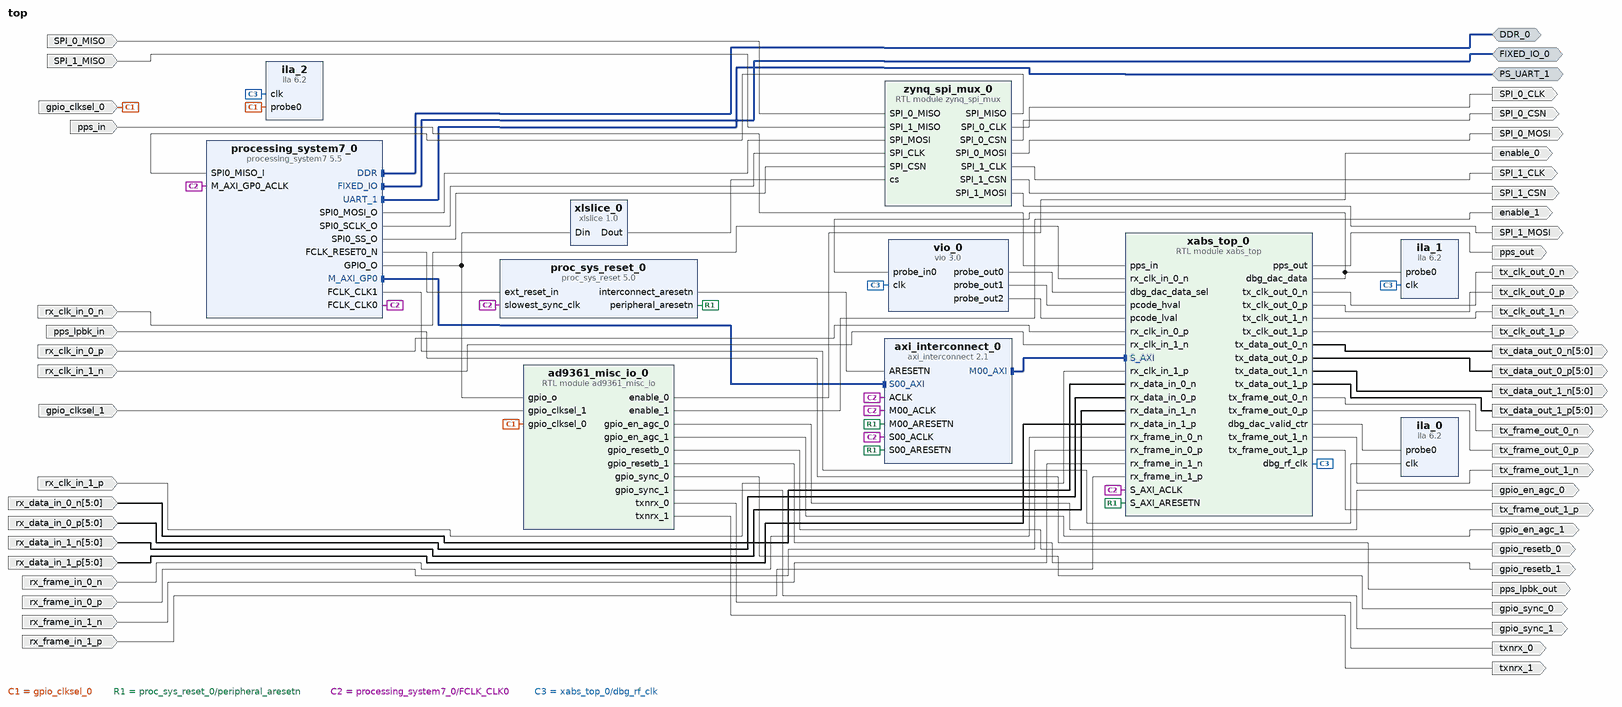
[diagram p0: block diagram of the top level]
# Vivado block design top, xc7z020clg400-2, Vivado 2023.2
create_bd_design top

create_bd_intf_port -mode Master -vlnv xilinx.com:interface:ddrx_rtl:1.0 DDR_0
create_bd_intf_port -mode Master -vlnv xilinx.com:display_processing_system7:fixedio_rtl:1.0 FIXED_IO_0
create_bd_intf_port -mode Master -vlnv xilinx.com:interface:uart_rtl:1.0 PS_UART_1
create_bd_port -dir I pps_in
create_bd_port -dir I rx_clk_in_0_n
create_bd_port -dir I rx_clk_in_0_p
create_bd_port -dir I rx_clk_in_1_n
create_bd_port -dir I rx_clk_in_1_p
create_bd_port -dir I -from 5 -to 0 rx_data_in_0_n
create_bd_port -dir I -from 5 -to 0 rx_data_in_0_p
create_bd_port -dir I -from 5 -to 0 rx_data_in_1_n
create_bd_port -dir I -from 5 -to 0 rx_data_in_1_p
create_bd_port -dir I rx_frame_in_0_n
create_bd_port -dir I rx_frame_in_0_p
create_bd_port -dir I rx_frame_in_1_n
create_bd_port -dir I rx_frame_in_1_p
create_bd_port -dir O tx_clk_out_0_n
create_bd_port -dir O tx_clk_out_0_p
create_bd_port -dir O tx_clk_out_1_n
create_bd_port -dir O tx_clk_out_1_p
create_bd_port -dir O -from 5 -to 0 tx_data_out_0_n
create_bd_port -dir O -from 5 -to 0 tx_data_out_0_p
create_bd_port -dir O -from 5 -to 0 tx_data_out_1_n
create_bd_port -dir O -from 5 -to 0 tx_data_out_1_p
create_bd_port -dir O tx_frame_out_0_n
create_bd_port -dir O tx_frame_out_0_p
create_bd_port -dir O tx_frame_out_1_n
create_bd_port -dir O tx_frame_out_1_p
create_bd_port -dir O enable_0
create_bd_port -dir O enable_1
create_bd_port -dir I gpio_clksel_0
create_bd_port -dir I gpio_clksel_1
create_bd_port -dir O gpio_en_agc_0
create_bd_port -dir O gpio_en_agc_1
create_bd_port -dir O gpio_resetb_0
create_bd_port -dir O gpio_resetb_1
create_bd_port -dir O gpio_sync_0
create_bd_port -dir O gpio_sync_1
create_bd_port -dir O txnrx_0
create_bd_port -dir O txnrx_1
create_bd_port -dir O -type clk SPI_0_CLK
create_bd_port -dir O SPI_0_CSN
create_bd_port -dir I SPI_0_MISO
create_bd_port -dir O SPI_0_MOSI
create_bd_port -dir O -type clk SPI_1_CLK
create_bd_port -dir O SPI_1_CSN
create_bd_port -dir I SPI_1_MISO
create_bd_port -dir O SPI_1_MOSI
create_bd_port -dir O pps_out
create_bd_port -dir I pps_lpbk_in
create_bd_port -dir O pps_lpbk_out

create_bd_cell -type ip -vlnv xilinx.com:ip:processing_system7:5.5 processing_system7_0
set_property -dict [list \
  CONFIG.PCW_APU_PERIPHERAL_FREQMHZ 767 \
  CONFIG.PCW_CPU_CPU_6X4X_MAX_RANGE 767 \
  CONFIG.PCW_DUAL_STACK_QSPI_DATA_MODE x4 \
  CONFIG.PCW_ENET0_ENET0_IO {MIO 16 .. 27} \
  CONFIG.PCW_ENET0_GRP_MDIO_ENABLE 1 \
  CONFIG.PCW_ENET0_GRP_MDIO_IO {MIO 52 .. 53} \
  CONFIG.PCW_ENET0_PERIPHERAL_ENABLE 1 \
  CONFIG.PCW_ENET_RESET_ENABLE 0 \
  CONFIG.PCW_EN_CLK1_PORT 1 \
  CONFIG.PCW_FCLK_CLK0_BUF FALSE \
  CONFIG.PCW_FPGA0_PERIPHERAL_FREQMHZ 100 \
  CONFIG.PCW_FPGA1_PERIPHERAL_FREQMHZ 200 \
  CONFIG.PCW_FPGA_FCLK1_ENABLE 1 \
  CONFIG.PCW_GPIO_EMIO_GPIO_ENABLE 1 \
  CONFIG.PCW_GPIO_EMIO_GPIO_IO 64 \
  CONFIG.PCW_GPIO_MIO_GPIO_ENABLE 1 \
  CONFIG.PCW_GPIO_MIO_GPIO_IO MIO \
  CONFIG.PCW_I2C_RESET_ENABLE 1 \
  CONFIG.PCW_IRQ_F2P_INTR 1 \
  CONFIG.PCW_PERIPHERAL_BOARD_PRESET None \
  CONFIG.PCW_PRESET_BANK1_VOLTAGE {LVCMOS 1.8V} \
  CONFIG.PCW_QSPI_GRP_SINGLE_SS_ENABLE 0 \
  CONFIG.PCW_QSPI_GRP_SS1_ENABLE 1 \
  CONFIG.PCW_QSPI_GRP_SS1_IO {MIO 0} \
  CONFIG.PCW_QSPI_INTERNAL_HIGHADDRESS 0xFDFFFFFF \
  CONFIG.PCW_QSPI_PERIPHERAL_ENABLE 1 \
  CONFIG.PCW_QSPI_QSPI_IO {MIO 1 .. 6} \
  CONFIG.PCW_SD0_GRP_CD_ENABLE 1 \
  CONFIG.PCW_SD0_GRP_CD_IO {MIO 46} \
  CONFIG.PCW_SD0_GRP_WP_ENABLE 0 \
  CONFIG.PCW_SD0_PERIPHERAL_ENABLE 1 \
  CONFIG.PCW_SD0_SD0_IO {MIO 40 .. 45} \
  CONFIG.PCW_SDIO_PERIPHERAL_FREQMHZ 100 \
  CONFIG.PCW_SPI0_PERIPHERAL_ENABLE 1 \
  CONFIG.PCW_SPI0_SPI0_IO EMIO \
  CONFIG.PCW_UART0_PERIPHERAL_ENABLE 1 \
  CONFIG.PCW_UART0_UART0_IO {MIO 10 .. 11} \
  CONFIG.PCW_UART1_PERIPHERAL_ENABLE 1 \
  CONFIG.PCW_UART1_UART1_IO EMIO \
  CONFIG.PCW_UART_PERIPHERAL_FREQMHZ 100 \
  CONFIG.PCW_UIPARAM_DDR_BUS_WIDTH {16 Bit} \
  CONFIG.PCW_UIPARAM_DDR_FREQ_MHZ 533.333 \
  CONFIG.PCW_UIPARAM_DDR_MEMORY_TYPE {DDR 3 (Low Voltage)} \
  CONFIG.PCW_UIPARAM_DDR_PARTNO {MT41K256M16 RE-125} \
  CONFIG.PCW_USB0_PERIPHERAL_ENABLE 1 \
  CONFIG.PCW_USB0_RESET_ENABLE 1 \
  CONFIG.PCW_USB0_RESET_IO {MIO 51} \
  CONFIG.PCW_USB0_USB0_IO {MIO 28 .. 39} \
  CONFIG.PCW_USB_RESET_ENABLE 1 \
  CONFIG.PCW_USB_RESET_SELECT {Share reset pin} \
  CONFIG.PCW_USE_FABRIC_INTERRUPT 1 \
  CONFIG.preset None \
] [get_bd_cells processing_system7_0]
# 512 more settings of processing_system7_0 are not shown: defaults, MIO pin electricals, DDR timing, and values the tool derives
create_bd_cell -type ip -vlnv xilinx.com:ip:proc_sys_reset:5.0 proc_sys_reset_0
create_bd_cell -type ip -vlnv xilinx.com:ip:axi_interconnect:2.1 axi_interconnect_0
set_property -dict {CONFIG.NUM_MI 1} [get_bd_cells axi_interconnect_0]
create_bd_cell -type ip -vlnv xilinx.com:ip:xlslice:1.0 xlslice_0
set_property -dict {CONFIG.DIN_FROM 4 CONFIG.DIN_TO 3 CONFIG.DIN_WIDTH 64 CONFIG.DOUT_WIDTH 2} [get_bd_cells xlslice_0]
create_bd_cell -type module -reference ad9361_misc_io ad9361_misc_io_0
create_bd_cell -type module -reference zynq_spi_mux zynq_spi_mux_0
create_bd_cell -type ip -vlnv xilinx.com:ip:ila:6.2 ila_0
set_property -dict {CONFIG.C_MONITOR_TYPE Native} [get_bd_cells ila_0]
create_bd_cell -type ip -vlnv xilinx.com:ip:vio:3.0 vio_0
set_property -dict [list \
  CONFIG.C_EN_PROBE_IN_ACTIVITY 0 \
  CONFIG.C_NUM_PROBE_IN 1 \
  CONFIG.C_NUM_PROBE_OUT 3 \
  CONFIG.C_PROBE_OUT0_WIDTH 8 \
  CONFIG.C_PROBE_OUT1_INIT_VAL 0x800 \
  CONFIG.C_PROBE_OUT1_WIDTH 12 \
  CONFIG.C_PROBE_OUT2_INIT_VAL 0x7ff \
  CONFIG.C_PROBE_OUT2_WIDTH 12 \
] [get_bd_cells vio_0]
create_bd_cell -type ip -vlnv xilinx.com:ip:ila:6.2 ila_1
set_property -dict {CONFIG.C_MONITOR_TYPE Native} [get_bd_cells ila_1]
create_bd_cell -type module -reference xabs_top xabs_top_0
set_property -dict {CONFIG.MESSAGE_LEN 100 CONFIG.PCODE_LEN 20460} [get_bd_cells xabs_top_0]
create_bd_cell -type ip -vlnv xilinx.com:ip:ila:6.2 ila_2
set_property -dict {CONFIG.C_DATA_DEPTH 1024 CONFIG.C_MONITOR_TYPE Native} [get_bd_cells ila_2]

# ---- connections ----

connect_bd_intf_net [get_bd_intf_pins axi_interconnect_0/S00_AXI] [get_bd_intf_pins processing_system7_0/M_AXI_GP0]
connect_bd_intf_net [get_bd_intf_pins axi_interconnect_0/M00_AXI] [get_bd_intf_pins xabs_top_0/S_AXI]
connect_bd_intf_net [get_bd_intf_ports DDR_0] [get_bd_intf_pins processing_system7_0/DDR]
connect_bd_intf_net [get_bd_intf_ports FIXED_IO_0] [get_bd_intf_pins processing_system7_0/FIXED_IO]
connect_bd_intf_net [get_bd_intf_ports PS_UART_1] [get_bd_intf_pins processing_system7_0/UART_1]
connect_bd_net -net SPI_0_MISO_0_1 [get_bd_ports SPI_0_MISO] [get_bd_pins zynq_spi_mux_0/SPI_0_MISO]
connect_bd_net -net SPI_1_MISO_0_1 [get_bd_ports SPI_1_MISO] [get_bd_pins zynq_spi_mux_0/SPI_1_MISO]
connect_bd_net [get_bd_pins ad9361_misc_io_0/enable_0] [get_bd_ports enable_0]
connect_bd_net [get_bd_pins ad9361_misc_io_0/enable_1] [get_bd_ports enable_1]
connect_bd_net [get_bd_pins ad9361_misc_io_0/gpio_en_agc_0] [get_bd_ports gpio_en_agc_0]
connect_bd_net [get_bd_pins ad9361_misc_io_0/gpio_en_agc_1] [get_bd_ports gpio_en_agc_1]
connect_bd_net [get_bd_pins ad9361_misc_io_0/gpio_resetb_0] [get_bd_ports gpio_resetb_0]
connect_bd_net [get_bd_pins ad9361_misc_io_0/gpio_resetb_1] [get_bd_ports gpio_resetb_1]
connect_bd_net [get_bd_pins ad9361_misc_io_0/gpio_sync_0] [get_bd_ports gpio_sync_0]
connect_bd_net [get_bd_pins ad9361_misc_io_0/gpio_sync_1] [get_bd_ports gpio_sync_1]
connect_bd_net [get_bd_pins ad9361_misc_io_0/txnrx_0] [get_bd_ports txnrx_0]
connect_bd_net [get_bd_pins ad9361_misc_io_0/txnrx_1] [get_bd_ports txnrx_1]
connect_bd_net -net gpio_clksel_0_0_1 [get_bd_ports gpio_clksel_0] [get_bd_pins ad9361_misc_io_0/gpio_clksel_0] [get_bd_pins ila_2/probe0]
connect_bd_net -net gpio_clksel_1_0_1 [get_bd_ports gpio_clksel_1] [get_bd_pins ad9361_misc_io_0/gpio_clksel_1]
connect_bd_net -net pps_in_0_1 [get_bd_ports pps_in] [get_bd_pins xabs_top_0/pps_in]
connect_bd_net [get_bd_ports pps_lpbk_in] [get_bd_ports pps_lpbk_out]
connect_bd_net [get_bd_pins proc_sys_reset_0/interconnect_aresetn] [get_bd_pins axi_interconnect_0/ARESETN]
connect_bd_net [get_bd_pins proc_sys_reset_0/peripheral_aresetn] \
  [get_bd_pins axi_interconnect_0/S00_ARESETN] [get_bd_pins axi_interconnect_0/M00_ARESETN] \
  [get_bd_pins xabs_top_0/S_AXI_ARESETN]
connect_bd_net [get_bd_pins processing_system7_0/FCLK_CLK0] \
  [get_bd_pins processing_system7_0/M_AXI_GP0_ACLK] [get_bd_pins proc_sys_reset_0/slowest_sync_clk] \
  [get_bd_pins axi_interconnect_0/ACLK] [get_bd_pins axi_interconnect_0/S00_ACLK] [get_bd_pins axi_interconnect_0/M00_ACLK] \
  [get_bd_pins xabs_top_0/S_AXI_ACLK]
connect_bd_net [get_bd_pins processing_system7_0/FCLK_CLK1] [get_bd_pins ila_0/clk]
connect_bd_net [get_bd_pins processing_system7_0/FCLK_RESET0_N] [get_bd_pins proc_sys_reset_0/ext_reset_in]
connect_bd_net [get_bd_pins processing_system7_0/GPIO_O] [get_bd_pins ad9361_misc_io_0/gpio_o] [get_bd_pins xlslice_0/Din]
connect_bd_net [get_bd_pins processing_system7_0/SPI0_MOSI_O] [get_bd_pins zynq_spi_mux_0/SPI_MOSI]
connect_bd_net [get_bd_pins processing_system7_0/SPI0_SCLK_O] [get_bd_pins zynq_spi_mux_0/SPI_CLK]
connect_bd_net [get_bd_pins processing_system7_0/SPI0_SS_O] [get_bd_pins zynq_spi_mux_0/SPI_CSN]
connect_bd_net -net rx_clk_in_0_n_0_1 [get_bd_ports rx_clk_in_0_n] [get_bd_pins xabs_top_0/rx_clk_in_0_n]
connect_bd_net -net rx_clk_in_0_p_0_1 [get_bd_ports rx_clk_in_0_p] [get_bd_pins xabs_top_0/rx_clk_in_0_p]
connect_bd_net -net rx_clk_in_1_n_0_1 [get_bd_ports rx_clk_in_1_n] [get_bd_pins xabs_top_0/rx_clk_in_1_n]
connect_bd_net -net rx_clk_in_1_p_0_1 [get_bd_ports rx_clk_in_1_p] [get_bd_pins xabs_top_0/rx_clk_in_1_p]
connect_bd_net -net rx_data_in_0_n_0_1 [get_bd_ports rx_data_in_0_n] [get_bd_pins xabs_top_0/rx_data_in_0_n]
connect_bd_net -net rx_data_in_0_p_0_1 [get_bd_ports rx_data_in_0_p] [get_bd_pins xabs_top_0/rx_data_in_0_p]
connect_bd_net -net rx_data_in_1_n_0_1 [get_bd_ports rx_data_in_1_n] [get_bd_pins xabs_top_0/rx_data_in_1_n]
connect_bd_net -net rx_data_in_1_p_0_1 [get_bd_ports rx_data_in_1_p] [get_bd_pins xabs_top_0/rx_data_in_1_p]
connect_bd_net -net rx_frame_in_0_n_0_1 [get_bd_ports rx_frame_in_0_n] [get_bd_pins xabs_top_0/rx_frame_in_0_n]
connect_bd_net -net rx_frame_in_0_p_0_1 [get_bd_ports rx_frame_in_0_p] [get_bd_pins xabs_top_0/rx_frame_in_0_p]
connect_bd_net -net rx_frame_in_1_n_0_1 [get_bd_ports rx_frame_in_1_n] [get_bd_pins xabs_top_0/rx_frame_in_1_n]
connect_bd_net -net rx_frame_in_1_p_0_1 [get_bd_ports rx_frame_in_1_p] [get_bd_pins xabs_top_0/rx_frame_in_1_p]
connect_bd_net [get_bd_pins vio_0/probe_out0] [get_bd_pins xabs_top_0/dbg_dac_data_sel]
connect_bd_net [get_bd_pins vio_0/probe_out1] [get_bd_pins xabs_top_0/pcode_hval]
connect_bd_net [get_bd_pins vio_0/probe_out2] [get_bd_pins xabs_top_0/pcode_lval]
connect_bd_net [get_bd_pins xabs_top_0/dbg_dac_data] [get_bd_pins ila_1/probe0] [get_bd_pins vio_0/probe_in0]
connect_bd_net [get_bd_pins xabs_top_0/dbg_dac_valid_ctr] [get_bd_pins ila_0/probe0]
connect_bd_net [get_bd_pins xabs_top_0/dbg_rf_clk] [get_bd_pins ila_1/clk] [get_bd_pins vio_0/clk] [get_bd_pins ila_2/clk]
connect_bd_net [get_bd_pins xabs_top_0/pps_out] [get_bd_ports pps_out]
connect_bd_net [get_bd_pins xabs_top_0/tx_clk_out_0_n] [get_bd_ports tx_clk_out_0_n]
connect_bd_net [get_bd_pins xabs_top_0/tx_clk_out_0_p] [get_bd_ports tx_clk_out_0_p]
connect_bd_net [get_bd_pins xabs_top_0/tx_clk_out_1_n] [get_bd_ports tx_clk_out_1_n]
connect_bd_net [get_bd_pins xabs_top_0/tx_clk_out_1_p] [get_bd_ports tx_clk_out_1_p]
connect_bd_net [get_bd_pins xabs_top_0/tx_data_out_0_n] [get_bd_ports tx_data_out_0_n]
connect_bd_net [get_bd_pins xabs_top_0/tx_data_out_0_p] [get_bd_ports tx_data_out_0_p]
connect_bd_net [get_bd_pins xabs_top_0/tx_data_out_1_n] [get_bd_ports tx_data_out_1_n]
connect_bd_net [get_bd_pins xabs_top_0/tx_data_out_1_p] [get_bd_ports tx_data_out_1_p]
connect_bd_net [get_bd_pins xabs_top_0/tx_frame_out_0_n] [get_bd_ports tx_frame_out_0_n]
connect_bd_net [get_bd_pins xabs_top_0/tx_frame_out_0_p] [get_bd_ports tx_frame_out_0_p]
connect_bd_net [get_bd_pins xabs_top_0/tx_frame_out_1_n] [get_bd_ports tx_frame_out_1_n]
connect_bd_net [get_bd_pins xabs_top_0/tx_frame_out_1_p] [get_bd_ports tx_frame_out_1_p]
connect_bd_net [get_bd_pins xlslice_0/Dout] [get_bd_pins zynq_spi_mux_0/cs]
connect_bd_net [get_bd_pins zynq_spi_mux_0/SPI_MISO] [get_bd_pins processing_system7_0/SPI0_MISO_I]
connect_bd_net -net zynq_spi_mux_0_upgraded_ipi_SPI_0_CLK [get_bd_pins zynq_spi_mux_0/SPI_0_CLK] [get_bd_ports SPI_0_CLK]
connect_bd_net -net zynq_spi_mux_0_upgraded_ipi_SPI_0_CSN [get_bd_pins zynq_spi_mux_0/SPI_0_CSN] [get_bd_ports SPI_0_CSN]
connect_bd_net -net zynq_spi_mux_0_upgraded_ipi_SPI_0_MOSI [get_bd_pins zynq_spi_mux_0/SPI_0_MOSI] [get_bd_ports SPI_0_MOSI]
connect_bd_net -net zynq_spi_mux_0_upgraded_ipi_SPI_1_CLK [get_bd_pins zynq_spi_mux_0/SPI_1_CLK] [get_bd_ports SPI_1_CLK]
connect_bd_net -net zynq_spi_mux_0_upgraded_ipi_SPI_1_CSN [get_bd_pins zynq_spi_mux_0/SPI_1_CSN] [get_bd_ports SPI_1_CSN]
connect_bd_net -net zynq_spi_mux_0_upgraded_ipi_SPI_1_MOSI [get_bd_pins zynq_spi_mux_0/SPI_1_MOSI] [get_bd_ports SPI_1_MOSI]

# ---- address map ----
assign_bd_address -offset 0x40000000 -range 64K -target_address_space [get_bd_addr_spaces processing_system7_0/Data] [get_bd_addr_segs xabs_top_0/S_AXI/reg0]

validate_bd_design
save_bd_design
